# Altium schematic sheet Motor Controller.SchDoc
size A4; SheetNumber: 4; SheetTotal: 4
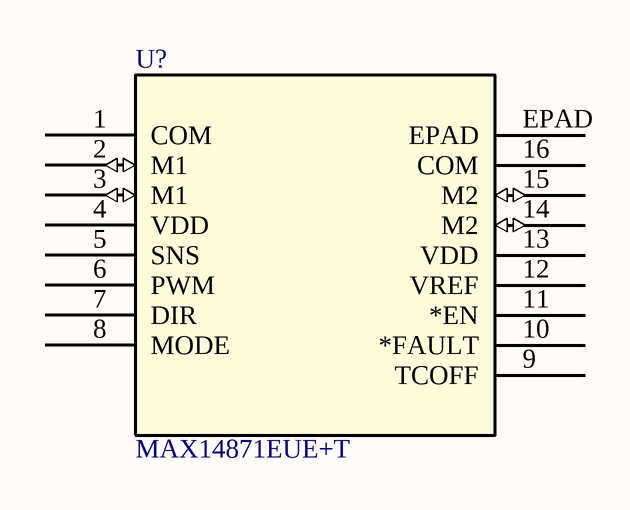
[diagram p0: Motor Controller.SchDoc]

## Parts
U?  MAX14871EUE+T  [U-MAX14871EUE+T]

## Nets

Not connected (* = marked no-connect by the designer): U? 1(COM) 2(M1) 3(M1) 4(VDD) 5(SNS) 6(PWM) 7(DIR) 8(MODE) 9(TCOFF) 10(*FAULT) 11(*EN) 12(VREF) 13(VDD) 14(M2) 15(M2) 16(COM) EPAD

## Library data of the parts
U? = U-MAX14871EUE+T: IC MOTOR DRIVER 4.5V-36V 16TSSOP; Manufacturer: Maxim Integrated Products; Manufacturer Part #: MAX14871EUE+T; Distributor Part #: MAX14871EUE+CT-ND; Distributor: Digikey